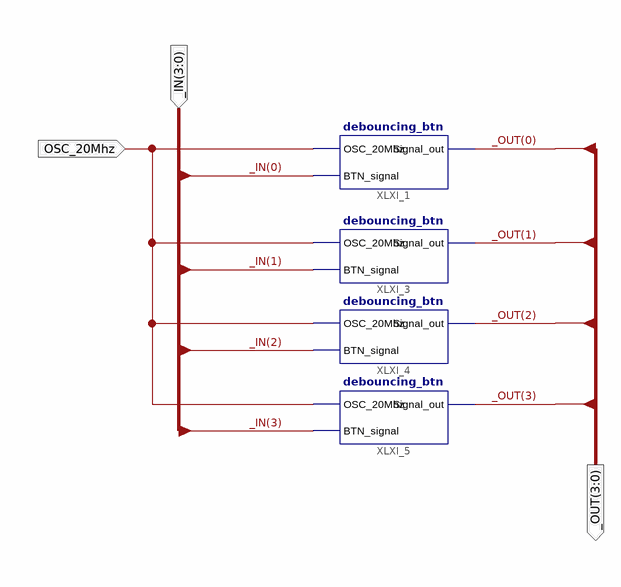
[diagram p0: schematic sheet 1]
// Xilinx ISE schematic Button_Controller.sch (spartan6) as structural Verilog: 4 symbols, 3 ports
module Button_Controller (
  input  OSC_20Mhz,
  input  [3:0] _IN,
  output [3:0] _OUT
);

  debouncing_btn XLXI_1 (.OSC_20Mhz(OSC_20Mhz), .BTN_signal(_IN[0]), .Signal_out(_OUT[0]));
  debouncing_btn XLXI_3 (.OSC_20Mhz(OSC_20Mhz), .BTN_signal(_IN[1]), .Signal_out(_OUT[1]));
  debouncing_btn XLXI_4 (.OSC_20Mhz(OSC_20Mhz), .BTN_signal(_IN[2]), .Signal_out(_OUT[2]));
  debouncing_btn XLXI_5 (.OSC_20Mhz(OSC_20Mhz), .BTN_signal(_IN[3]), .Signal_out(_OUT[3]));
endmodule
